# Altium project Aarons_MnDOT_Board_V1.1.PrjPcb
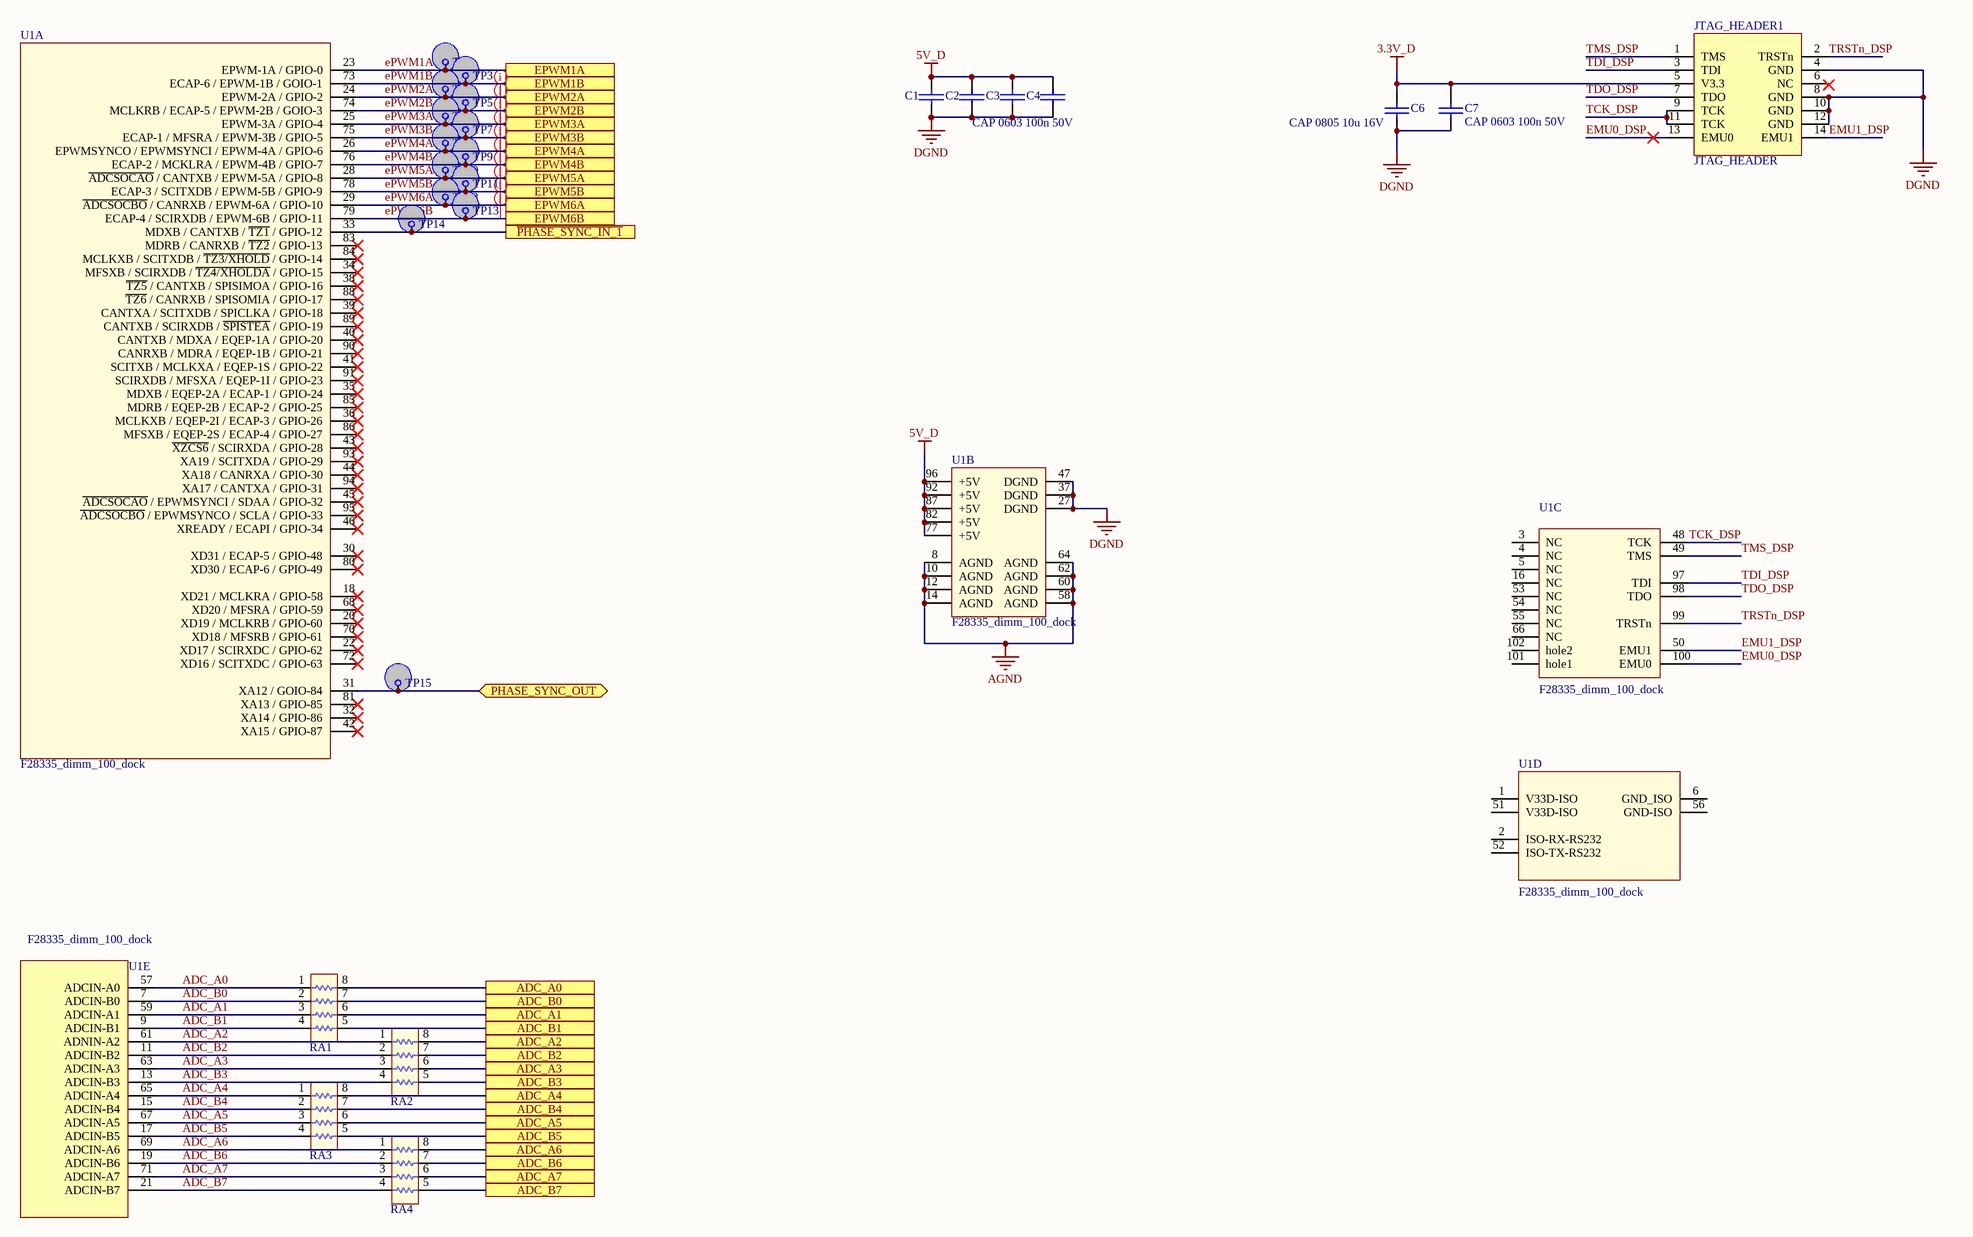
[diagram p0: F28335_V1.1.SchDoc]
3 sheets, 92 parts. Net scope: hierarchical (ports join the sheet entries above them; power ports are global).
Board file: Aarons_MnDOT_Board_V1.1.PcbDoc
Sheets:
  F28335_V1.1.SchDoc
  Power_Supply_V1.1.SchDoc
  Main_V1.1.SchDoc

## Sheet F28335_V1.1.SchDoc
size C

### Parts
C1  CAP 0603 100n 50V  [CAPC1608N]
C2  CAP 0603 100n 50V  [CAPC1608N]  (value not drawn)
C3  CAP 0603 100n 50V  [CAPC1608N]  (value not drawn)
C4  CAP 0603 100n 50V  [CAPC1608N]  (value not drawn)
C6  CAP 0805 10u 16V  [CAPC2012N]
C7  CAP 0603 100n 50V  [CAPC1608N]
JTAG_HEADER1  JTAG_HEADER  [JTag_Header]
RA1  EXB38V 0 OHM  [EXB38V]  (value not drawn)
RA2  EXB38V 0 OHM  [EXB38V]  (value not drawn)
RA3  EXB38V 0 OHM  [EXB38V]  (value not drawn)
RA4  EXB38V 0 OHM  [EXB38V]  (value not drawn)
TP2  TEST_POINT_HOOK  [Keystone 5000]  (value not drawn)
TP3  TEST_POINT_HOOK  [Keystone 5000]  (value not drawn)
TP4  TEST_POINT_HOOK  [Keystone 5000]  (value not drawn)
TP5  TEST_POINT_HOOK  [Keystone 5000]  (value not drawn)
TP6  TEST_POINT_HOOK  [Keystone 5000]  (value not drawn)
TP7  TEST_POINT_HOOK  [Keystone 5000]  (value not drawn)
TP8  TEST_POINT_HOOK  [Keystone 5000]  (value not drawn)
TP9  TEST_POINT_HOOK  [Keystone 5000]  (value not drawn)
TP10  TEST_POINT_HOOK  [Keystone 5000]  (value not drawn)
TP11  TEST_POINT_HOOK  [Keystone 5000]  (value not drawn)
TP12  TEST_POINT_HOOK  [Keystone 5000]  (value not drawn)
TP13  TEST_POINT_HOOK  [Keystone 5000]  (value not drawn)
TP14  TEST_POINT_HOOK  [Keystone 5000]  (value not drawn)
TP15  TEST_POINT_HOOK  [Keystone 5000]  (value not drawn)
U1  F28335_dimm_100_dock  [DIMM_100_100mil]  (parts A,B,C,D,E of 5)

### Ports
ADC_A0, ADC_A1, ADC_A2, ADC_A3, ADC_A4, ADC_A5, ADC_A6, ADC_A7, ADC_B0, ADC_B1, ADC_B2, ADC_B3, ADC_B4, ADC_B5, ADC_B6, ADC_B7, EPWM1A, EPWM1B, EPWM2A, EPWM2B, EPWM3A, EPWM3B, EPWM4A, EPWM4B, EPWM5A, EPWM5B, EPWM6A, EPWM6B, PHASE_SYNC_OUT, ~{PHASE_SYNC_IN_1}

### Nets
3.3V_D: C6.1 C7.1 JTAG_HEADER1.5(V3.3)
5V_D: C1.1 C2.1 C3.1 C4.1 U1.77(+5V) U1.82(+5V) U1.87(+5V) U1.92(+5V) U1.96(+5V)
AGND: U1.8(AGND) U1.10(AGND) U1.12(AGND) U1.14(AGND) U1.58(AGND) U1.60(AGND) U1.62(AGND) U1.64(AGND)
DGND: C1.2 C2.2 C3.2 C4.2 C6.2 C7.2 JTAG_HEADER1.4(GND) JTAG_HEADER1.8(GND) JTAG_HEADER1.10(GND) JTAG_HEADER1.12(GND) U1.27(DGND) U1.37(DGND) U1.47(DGND)
ADC_A0: RA1.1 U1.57(ADCIN-A0)
ADC_A1: RA1.3 U1.59(ADCIN-A1)
ADC_A2: RA2.1 U1.61(ADNIN-A2)
ADC_A3: RA2.3 U1.63(ADCIN-A3)
ADC_A4: RA3.1 U1.65(ADCIN-A4)
ADC_A5: RA3.3 U1.67(ADCIN-A5)
ADC_A6: RA4.1 U1.69(ADCIN-A6)
ADC_A7: RA4.3 U1.71(ADCIN-A7)
ADC_B0: RA1.2 U1.7(ADCIN-B0)
ADC_B1: RA1.4 U1.9(ADCIN-B1)
ADC_B2: RA2.2 U1.11(ADCIN-B2)
ADC_B3: RA2.4 U1.13(ADCIN-B3)
ADC_B4: RA3.2 U1.15(ADCIN-B4)
ADC_B5: RA3.4 U1.17(ADCIN-B5)
ADC_B6: RA4.2 U1.19(ADCIN-B6)
ADC_B7: RA4.4 U1.21(ADCIN-B7)
EMU0_DSP: JTAG_HEADER1.13(EMU0) U1.100(EMU0)
EMU1_DSP: JTAG_HEADER1.14(EMU1) U1.50(EMU1)
ePWM1A: TP2.1 U1.23(EPWM-1A_/_GPIO-0) ; port EPWM1A
ePWM1B: TP3.1 U1.73(ECAP-6_/_EPWM-1B_/_GOIO-1) ; port EPWM1B
ePWM2A: TP4.1 U1.24(EPWM-2A_/_GPIO-2) ; port EPWM2A
ePWM2B: TP5.1 U1.74(MCLKRB_/_ECAP-5_/_EPWM-2B_/_GOIO-3) ; port EPWM2B
ePWM3A: TP6.1 U1.25(EPWM-3A_/_GPIO-4) ; port EPWM3A
ePWM3B: TP7.1 U1.75(ECAP-1_/_MFSRA_/_EPWM-3B_/_GPIO-5) ; port EPWM3B
ePWM4A: TP8.1 U1.26(EPWMSYNCO_/_EPWMSYNCI_/_EPWM-4A_/_GPIO-6) ; port EPWM4A
ePWM4B: TP9.1 U1.76(ECAP-2_/_MCKLRA_/_EPWM-4B_/_GPIO-7) ; port EPWM4B
ePWM5A: TP10.1 U1.28(~{ADCSOCAO}_/_CANTXB_/_EPWM-5A_/_GPIO-8) ; port EPWM5A
ePWM5B: TP11.1 U1.78(ECAP-3_/_SCITXDB_/_EPWM-5B_/_GPIO-9) ; port EPWM5B
ePWM6A: TP12.1 U1.29(~{ADCSOCBO}_/_CANRXB_/_EPWM-6A_/_GPIO-10) ; port EPWM6A
ePWM6B: TP13.1 U1.79(ECAP-4_/_SCIRXDB_/_EPWM-6B_/_GPIO-11) ; port EPWM6B
TCK_DSP: JTAG_HEADER1.9(TCK) JTAG_HEADER1.11(TCK) U1.48(TCK)
TDI_DSP: JTAG_HEADER1.3(TDI) U1.97(TDI)
TDO_DSP: JTAG_HEADER1.7(TDO) U1.98(TDO)
TMS_DSP: JTAG_HEADER1.1(TMS) U1.49(TMS)
TRSTn_DSP: JTAG_HEADER1.2(TRSTn) U1.99(TRSTn)
NetRA1_5: RA1.5 ; port ADC_B1
NetRA1_6: RA1.6 ; port ADC_A1
NetRA1_7: RA1.7 ; port ADC_B0
NetRA1_8: RA1.8 ; port ADC_A0
NetRA2_5: RA2.5 ; port ADC_B3
NetRA2_6: RA2.6 ; port ADC_A3
NetRA2_7: RA2.7 ; port ADC_B2
NetRA2_8: RA2.8 ; port ADC_A2
NetRA3_5: RA3.5 ; port ADC_B5
NetRA3_6: RA3.6 ; port ADC_A5
NetRA3_7: RA3.7 ; port ADC_B4
NetRA3_8: RA3.8 ; port ADC_A4
NetRA4_5: RA4.5 ; port ADC_B7
NetRA4_6: RA4.6 ; port ADC_A7
NetRA4_7: RA4.7 ; port ADC_B6
NetRA4_8: RA4.8 ; port ADC_A6
NetTP14_1: TP14.1 U1.33(MDXB_/_CANTXB_/_~{TZ1}_/_GPIO-12) ; port ~{PHASE_SYNC_IN_1}
NetTP15_1: TP15.1 U1.31(XA12_/_GOIO-84) ; port PHASE_SYNC_OUT

Not connected (* = marked no-connect by the designer): JTAG_HEADER1 6(NC); U1 1(V33D-ISO) 2(ISO-RX-RS232) 3(NC) 4(NC) 5(NC) 6(GND_ISO) 16(NC) 18(XD21_/_MCLKRA_/_GPIO-58)* 20(XD19_/_MCLKRB_/_GPIO-60)* 22(XD17_/_SCIRXDC_/_GPIO-62)* 30(XD31_/_ECAP-5_/_GPIO-48)* 32(XA14_/_GPIO-86)* 34(MFSXB_/_SCIRXDB_/_~{TZ4/XHOLDA}_/_GPIO-15)* 35(MDXB_/_EQEP-2A_/_ECAP-1_/_GPIO-24)* 36(MCLKXB_/_EQEP-2I_/_ECAP-3_/_GPIO-26)* 38(~{TZ5}_/_CANTXB_/_SPISIMOA_/_GPIO-16)* 39(CANTXA_/_SCITXDB_/_SPICLKA_/_GPIO-18)* 40(CANTXB_/_MDXA_/_EQEP-1A_/_GPIO-20)* 41(SCITXB_/_MCLKXA_/_EQEP-1S_/_GPIO-22)* 42(XA15_/_GPIO-87)* 43(~{XZCS6}_/_SCIRXDA_/_GPIO-28)* 44(XA18_/_CANRXA_/_GPIO-30)* 45(~{ADCSOCAO}_/_EPWMSYNCI_/_SDAA_/_GPIO-32)* 46(XREADY_/_ECAPI_/_GPIO-34)* 51(V33D-ISO) 52(ISO-TX-RS232) 53(NC) 54(NC) 55(NC) 56(GND-ISO) 66(NC) 68(XD20_/_MFSRA_/_GPIO-59)* 70(XD18_/_MFSRB_/_GPIO-61)* 72(XD16_/_SCITXDC_/_GPIO-63)* 80(XD30_/_ECAP-6_/_GPIO-49)* 81(XA13_/_GPIO-85)* 83(MDRB_/_CANRXB_/_~{TZ2}_/_GPIO-13)* 84(MCLKXB_/_SCITXDB_/_~{TZ3/XHOLD}_/_GPIO-14)* 85(MDRB_/_EQEP-2B_/_ECAP-2_/_GPIO-25)* 86(MFSXB_/_EQEP-2S_/_ECAP-4_/_GPIO-27)* 88(~{TZ6}_/_CANRXB_/_SPISOMIA_/_GPIO-17)* 89(CANTXB_/_SCIRXDB_/_~{SPISTEA}_/_GPIO-19)* 90(CANRXB_/_MDRA_/_EQEP-1B_/_GPIO-21)* 91(SCIRXDB_/_MFSXA_/_EQEP-1I_/_GPIO-23)* 93(XA19_/_SCITXDA_/_GPIO-29)* 94(XA17_/_CANTXA_/_GPIO-31)* 95(~{ADCSOCBO}_/_EPWMSYNCO_/_SCLA_/_GPIO-33)* 101(hole1) 102(hole2)

### Layout directives
net class FPGA: ePWM2A, ePWM2B, ePWM3A, ePWM3B, ePWM4A, ePWM4B, ePWM5A, ePWM5B, ePWM6A, ePWM6B

### Library data of the parts
C1-C4 C7 = CAP 0603 TBD: Vendor: TBD; Part#: TBD; Manuf: TBD; Manuf#: TBD; Cost: TBD
C6 = CAP 0805 TBD: Vendor: TBD; Part#: TBD; Manuf: TBD; Manuf#: TBD; Cost: TBD
JTAG_HEADER1 = JTAG_HEADER: Part#: 929975E-01-05-ND; Manuf: 3M; Manuf#: 929975-01-05-RK; Vendor: Digikey; Cost@10: 1.807
RA1-RA4 = EXB38V: EXB38V 0603*4 TBD

## Sheet Power_Supply_V1.1.SchDoc
size A4
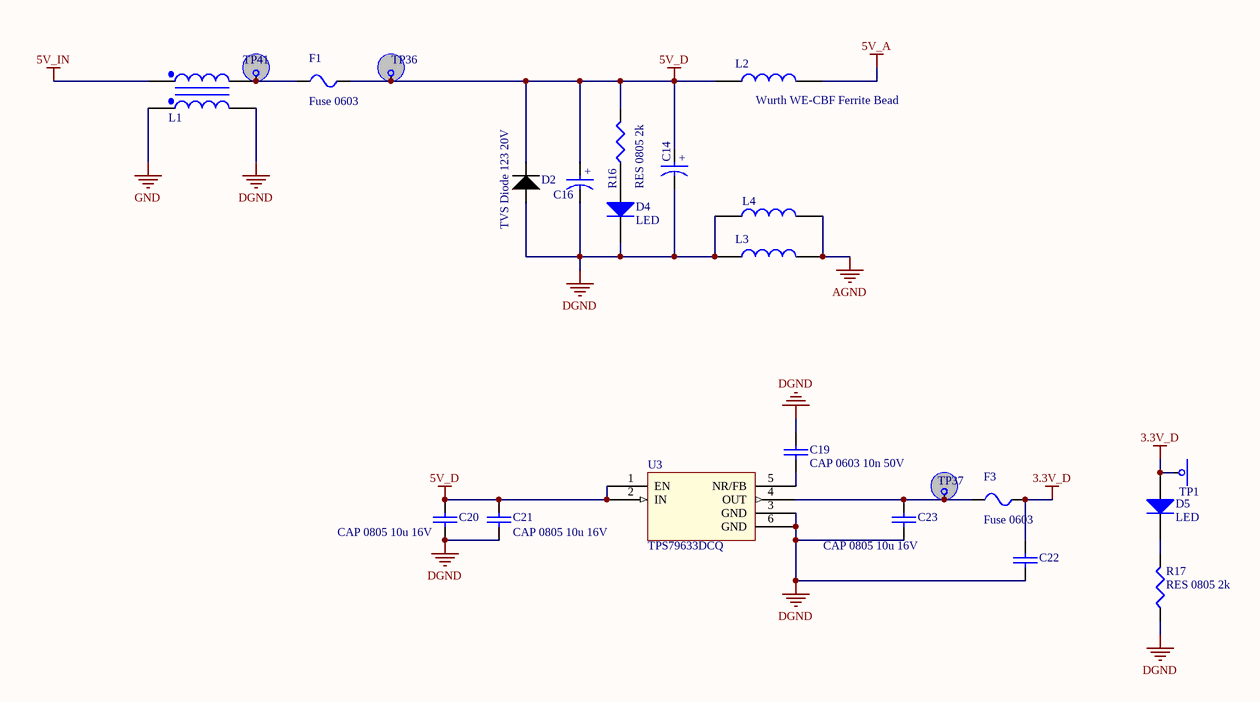
[diagram p1: Power_Supply_V1.1.SchDoc]

### Parts
C14  Panasonic SMD aluminum cap FT V size d  [Panasonic TF V SMD size D cap]  (value not drawn)
C16  Panasonic SMD aluminum cap FT V size d  [Panasonic TF V SMD size D cap]  (value not drawn)
C19  CAP 0603 10n 50V  [CAPC1608N]
C20  CAP 0805 10u 16V  [CAPC2012N]
C21  CAP 0805 10u 16V  [CAPC2012N]
C22  CAP 0805 10u 16V  [CAPC2012N]  (value not drawn)
C23  CAP 0805 10u 16V  [CAPC2012N]
D2  TVS Diode 123 20V  [SOD-123]
D4  LED  [LED1608N]
D5  LED  [LED1608N]
F1  Fuse 0603  [RES1608N]
F3  Fuse 0603  [RES1608N]
L1  Wurth  [WURTH WE-SL5]  (value not drawn)
L2  Wurth WE-CBF Ferrite Bead  [Wurth WE-CBF]  (value not drawn)
L3  Wurth WE-CBF Ferrite Bead  [Wurth WE-CBF]
L4  Wurth WE-CBF Ferrite Bead  [Wurth WE-CBF]  (value not drawn)
R16  RES 0805 2k  [RES2012N]
R17  RES 0805 2k  [RES2012N]
TP1  TEST_POINT_HOOK  [Keystone 5000]  (value not drawn)
TP36  *  [Keystone 5000]  (value not drawn)
TP37  *  [Keystone 5000]  (value not drawn)
TP41  TEST_POINT_HOOK  [Keystone 5000]  (value not drawn)
U3  TPS79633DCQ  [SOT-223-6]

### Nets
3.3V_D: C22.1 D5.1 F3.2 TP1.1
5V_A: L2.2
5V_D: C14.1 C16.1 C20.1 C21.1 D2.1(C) F1.2 L2.1 R16.2 TP36.1 U3.1(EN) U3.2(IN)
5V_IN: L1.1
AGND: L3.2 L4.2
DGND: C14.2 C16.2 C19.1 C20.2 C21.2 C22.2 C23.2 D2.2(A) D4.2 L1.3 L3.1 L4.1 R17.1 U3.3(GND) U3.6(GND)
GND: L1.4
NetC19_2: C19.2 U3.5(NR/FB)
NetC23_1: C23.1 F3.1 TP37.1 U3.4(OUT)
NetD4_1: D4.1 R16.1
NetD5_2: D5.2 R17.2
NetF1_1: F1.1 L1.2 TP41.1

### Notes on the sheet
- (in symbol Panasonic SMD aluminum cap FT V size d) +

### Library data of the parts
C14 C16 = Panasonic SMD aluminum cap FT V size d: Manuf: Panasonic - ECG; Vendor: DIGIKEY; Cost@10: 0.844
C19 = CAP 0603 TBD: Vendor: TBD; Part#: TBD; Manuf: TBD; Manuf#: TBD; Cost: TBD
C20-C23 = CAP 0805 TBD: Vendor: TBD; Part#: TBD; Manuf: TBD; Manuf#: TBD; Cost: TBD
D2 = TVS Diode TBD
D4 D5 = LED: Manuf: OSRAM; Manuf#: LG M67K-G1J2-24-0-2-R18-Z; Part#: 475-1406-1-ND; Vendor: Digikey; Cost@10: 0.17
L1 = Wurth WE-SL5: Wurth WE-SL5 Common Mode Choke; Part Number: 811-1253-ND; Manufacturer Part Number: 51105C; Manufacturer: Murata Power Solutions Inc; Vendor: Digikey; Packaging: Vertical, 4 PC Pin, Through hole
L2-L4 = Wurth WE-CBF: Wurth WE-CBF Ferrite Bead 2A 0.15Ohm; Part Number: 811-1253-ND; Manufacturer Part Number: 51105C; Manufacturer: Murata Power Solutions Inc; Vendor: Digikey; Packaging: Vertical, 4 PC Pin, Through hole
R16 R17 = RES 0805 TBD: Manuf#: TBD; Manuf: TBD; Vendor: TBD; Cost@10: TBD; Part#: TBD
TP36 TP37 = TEST_POINT_HOOK
U3 = TPS79633: Single Output LDO, 1.0A, Fixed(3.3V), Low Noise, High PSRR; Manufacturer_Part_Number: tps79633_dcq_6; Vendor: Texas Instruments; PACKAGE_DESIGNATOR: DCQ; PIN_COUNT: 6; FAMILY_NAME: SINGLE CHANNEL LDO; INDUSTRY_STD_PKG_TYPE: SOT-223; GENERIC_PART_NUMBER: TPS79633; Datasheet URL: http://www.ti.com/lit/gpn/TPS79633; Manufacturer: Texas Instruments; RefDes: RefDes; Type: DEV; Value: Value; Supplier 1: Digi-Key; Supplier 2: Newark

## Sheet Main_V1.1.SchDoc
size B
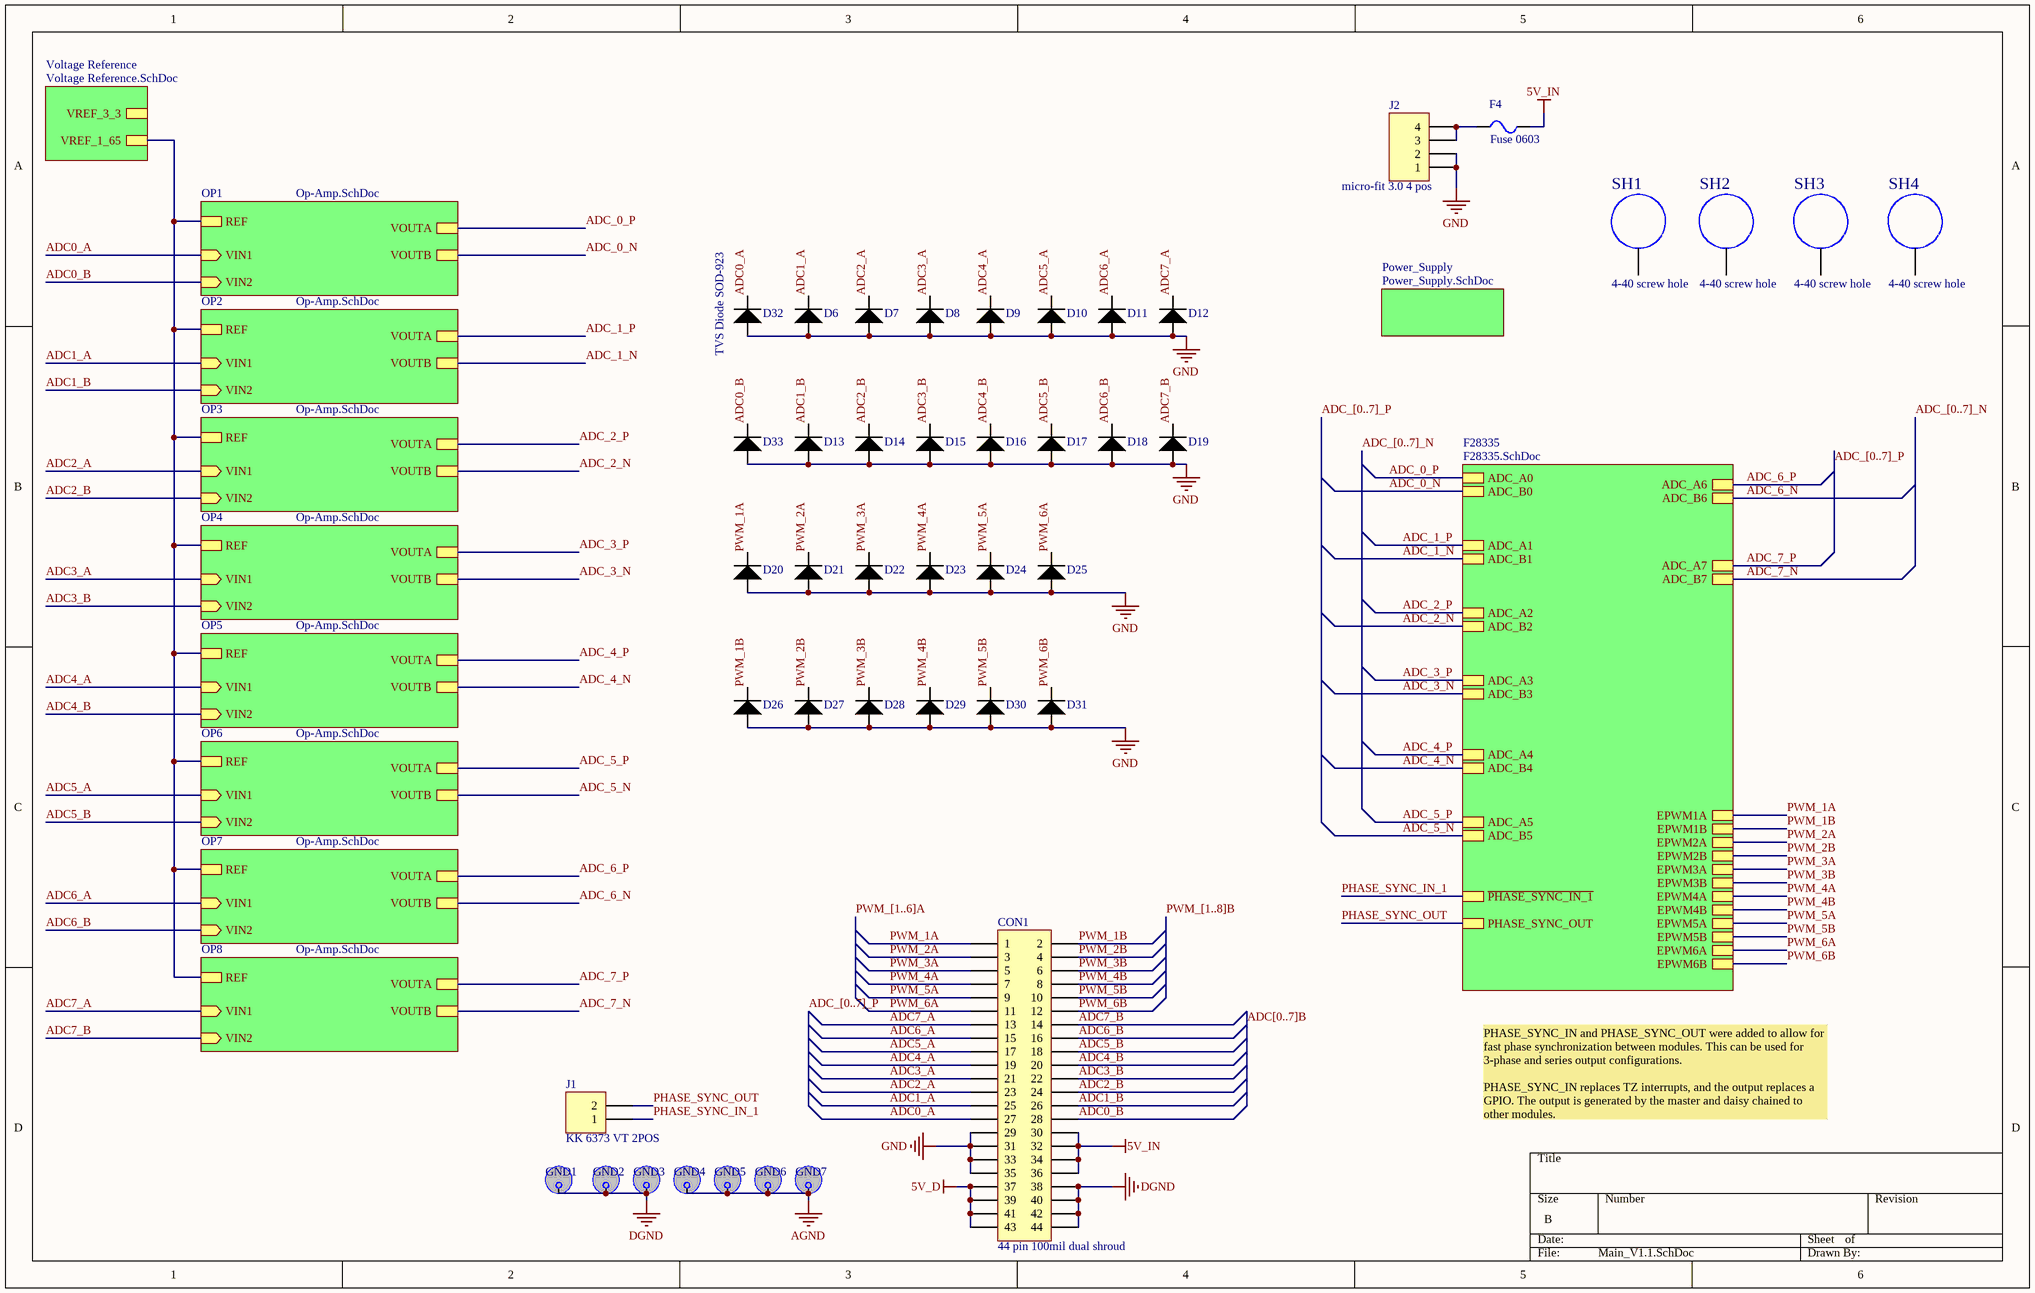
[diagram p2: Main_V1.1.SchDoc]

### Parts
CON1  44 pin 100mil dual shroud  [44 PIN 100 MIL DUAL UNSHROUD]
D6  TVS Diode SOD-923  [SOD-923-2]
D7  TVS Diode SOD-923  [SOD-923-2]  (value not drawn)
D8  TVS Diode SOD-923  [SOD-923-2]  (value not drawn)
D9  TVS Diode SOD-923  [SOD-923-2]  (value not drawn)
D10  TVS Diode SOD-923  [SOD-923-2]  (value not drawn)
D11  TVS Diode SOD-923  [SOD-923-2]  (value not drawn)
D12  TVS Diode SOD-923  [SOD-923-2]  (value not drawn)
D13  TVS Diode SOD-923  [SOD-923-2]  (value not drawn)
D14  TVS Diode SOD-923  [SOD-923-2]  (value not drawn)
D15  TVS Diode SOD-923  [SOD-923-2]  (value not drawn)
D16  TVS Diode SOD-923  [SOD-923-2]  (value not drawn)
D17  TVS Diode SOD-923  [SOD-923-2]  (value not drawn)
D18  TVS Diode SOD-923  [SOD-923-2]  (value not drawn)
D19  TVS Diode SOD-923  [SOD-923-2]  (value not drawn)
D20  TVS Diode SOD-923  [SOD-923-2]  (value not drawn)
D21  TVS Diode SOD-923  [SOD-923-2]  (value not drawn)
D22  TVS Diode SOD-923  [SOD-923-2]  (value not drawn)
D23  TVS Diode SOD-923  [SOD-923-2]  (value not drawn)
D24  TVS Diode SOD-923  [SOD-923-2]  (value not drawn)
D25  TVS Diode SOD-923  [SOD-923-2]  (value not drawn)
D26  TVS Diode SOD-923  [SOD-923-2]  (value not drawn)
D27  TVS Diode SOD-923  [SOD-923-2]  (value not drawn)
D28  TVS Diode SOD-923  [SOD-923-2]  (value not drawn)
D29  TVS Diode SOD-923  [SOD-923-2]  (value not drawn)
D30  TVS Diode SOD-923  [SOD-923-2]  (value not drawn)
D31  TVS Diode SOD-923  [SOD-923-2]  (value not drawn)
D32  TVS Diode SOD-923  [SOD-923-2]  (value not drawn)
D33  TVS Diode SOD-923  [SOD-923-2]  (value not drawn)
F4  Fuse 0603  [RES1608N]
GND1  *  [Keystone 5000]  (value not drawn)
GND2  *  [Keystone 5000]  (value not drawn)
GND3  *  [Keystone 5000]  (value not drawn)
GND4  *  [Keystone 5000]  (value not drawn)
GND5  *  [Keystone 5000]  (value not drawn)
GND6  *  [Keystone 5000]  (value not drawn)
GND7  *  [Keystone 5000]  (value not drawn)
J1  KK 6373 VT 2POS  [KK 6373 VT 2POS]
J2  micro-fit 3.0 4 pos  [micro-fit 3.0 4 pos dual line]
SH1  4-40 screw hole  [4-40 screw hole]
SH2  4-40 screw hole  [4-40 screw hole]
SH3  4-40 screw hole  [4-40 screw hole]
SH4  4-40 screw hole  [4-40 screw hole]

### Sub-sheets
F28335 = F28335.SchDoc (file not in this document): ADC_B0, ADC_B1, ADC_B2, ADC_B3, ADC_A0, ADC_A1, ADC_A2, ADC_A3, EPWM1A, EPWM1B, EPWM2A, EPWM2B, EPWM3A, EPWM3B, EPWM4A, EPWM4B, EPWM5A, EPWM5B, EPWM6A, EPWM6B, ADC_B4, ADC_A4, ADC_B5, ADC_A5, ~{PHASE_SYNC_IN_1}, PHASE_SYNC_OUT, ADC_A6, ADC_B6, ADC_B7, ADC_A7
OP1 = Op-Amp.SchDoc (file not in this document): VIN1 (in), VIN2 (in), VOUTA, VOUTB, REF
OP2 = Op-Amp.SchDoc (file not in this document): VIN1 (in), VIN2 (in), VOUTA, VOUTB, REF
OP3 = Op-Amp.SchDoc (file not in this document): VIN1 (in), VIN2 (in), VOUTA, VOUTB, REF
OP4 = Op-Amp.SchDoc (file not in this document): VIN1 (in), VIN2 (in), VOUTA, VOUTB, REF
OP5 = Op-Amp.SchDoc (file not in this document): VIN1 (in), VIN2 (in), VOUTA, VOUTB, REF
OP6 = Op-Amp.SchDoc (file not in this document): VIN1 (in), VIN2 (in), VOUTA, VOUTB, REF
OP7 = Op-Amp.SchDoc (file not in this document): VIN1 (in), VIN2 (in), VOUTA, VOUTB, REF
OP8 = Op-Amp.SchDoc (file not in this document): VIN1 (in), VIN2 (in), VOUTA, VOUTB, REF
Power_Supply = Power_Supply.SchDoc (file not in this document): no entries
Voltage Reference = Voltage Reference.SchDoc (file not in this document): VREF_1_65, VREF_3_3

### Nets
5V_D: CON1.37 CON1.39 CON1.41 CON1.43
5V_IN: CON1.30 CON1.32 CON1.34 CON1.36 F4.2
AGND: GND4.1 GND5.1 GND6.1 GND7.1
DGND: CON1.38 CON1.40 CON1.42 CON1.44 GND1.1 GND2.1 GND3.1
GND: CON1.29 CON1.31 CON1.33 CON1.35 D6.2(A) D7.2(A) D8.2(A) D9.2(A) D10.2(A) D11.2(A) D12.2(A) D13.2(A) D14.2(A) D15.2(A) D16.2(A) D17.2(A) D18.2(A) D19.2(A) D20.2(A) D21.2(A) D22.2(A) D23.2(A) D24.2(A) D25.2(A) D26.2(A) D27.2(A) D28.2(A) D29.2(A) D30.2(A) D31.2(A) D32.2(A) D33.2(A) J2.1 J2.2
ADC0_A: CON1.27 D32.1(C) ; sheet OP1/VIN1
ADC0_B: CON1.28 D33.1(C) ; sheet OP1/VIN2
ADC1_A: CON1.25 D6.1(C) ; sheet OP2/VIN1
ADC1_B: CON1.26 D13.1(C) ; sheet OP2/VIN2
ADC2_A: CON1.23 D7.1(C) ; sheet OP3/VIN1
ADC2_B: CON1.24 D14.1(C) ; sheet OP3/VIN2
ADC3_A: CON1.21 D8.1(C) ; sheet OP4/VIN1
ADC3_B: CON1.22 D15.1(C) ; sheet OP4/VIN2
ADC4_A: CON1.19 D9.1(C) ; sheet OP5/VIN1
ADC4_B: CON1.20 D16.1(C) ; sheet OP5/VIN2
ADC5_A: CON1.17 D10.1(C) ; sheet OP6/VIN1
ADC5_B: CON1.18 D17.1(C) ; sheet OP6/VIN2
ADC6_A: CON1.15 D11.1(C) ; sheet OP7/VIN1
ADC6_B: CON1.16 D18.1(C) ; sheet OP7/VIN2
ADC7_A: CON1.13 D12.1(C) ; sheet OP8/VIN1
ADC7_B: CON1.14 D19.1(C) ; sheet OP8/VIN2
ADC_0_N: sheet F28335/ADC_B0, sheet OP1/VOUTB
ADC_0_P: sheet F28335/ADC_A0, sheet OP1/VOUTA
ADC_1_N: sheet F28335/ADC_B1, sheet OP2/VOUTB
ADC_1_P: sheet F28335/ADC_A1, sheet OP2/VOUTA
ADC_2_N: sheet F28335/ADC_B2, sheet OP3/VOUTB
ADC_2_P: sheet F28335/ADC_A2, sheet OP3/VOUTA
ADC_3_N: sheet F28335/ADC_B3, sheet OP4/VOUTB
ADC_3_P: sheet F28335/ADC_A3, sheet OP4/VOUTA
ADC_4_N: sheet F28335/ADC_B4, sheet OP5/VOUTB
ADC_4_P: sheet F28335/ADC_A4, sheet OP5/VOUTA
ADC_5_N: sheet F28335/ADC_B5, sheet OP6/VOUTB
ADC_5_P: sheet F28335/ADC_A5, sheet OP6/VOUTA
ADC_6_N: sheet F28335/ADC_B6, sheet OP7/VOUTB
ADC_6_P: sheet F28335/ADC_A6, sheet OP7/VOUTA
ADC_7_N: sheet F28335/ADC_B7, sheet OP8/VOUTB
ADC_7_P: sheet F28335/ADC_A7, sheet OP8/VOUTA
PHASE_SYNC_IN_1: J1.1 ; sheet F28335/~{PHASE_SYNC_IN_1}
PHASE_SYNC_OUT: J1.2 ; sheet F28335/PHASE_SYNC_OUT
PWM_1A: CON1.1 D20.1(C) ; sheet F28335/EPWM1A
PWM_1B: CON1.2 D26.1(C) ; sheet F28335/EPWM1B
PWM_2A: CON1.3 D21.1(C) ; sheet F28335/EPWM2A
PWM_2B: CON1.4 D27.1(C) ; sheet F28335/EPWM2B
PWM_3A: CON1.5 D22.1(C) ; sheet F28335/EPWM3A
PWM_3B: CON1.6 D28.1(C) ; sheet F28335/EPWM3B
PWM_4A: CON1.7 D23.1(C) ; sheet F28335/EPWM4A
PWM_4B: CON1.8 D29.1(C) ; sheet F28335/EPWM4B
PWM_5A: CON1.9 D24.1(C) ; sheet F28335/EPWM5A
PWM_5B: CON1.10 D30.1(C) ; sheet F28335/EPWM5B
PWM_6A: CON1.11 D25.1(C) ; sheet F28335/EPWM6A
PWM_6B: CON1.12 D31.1(C) ; sheet F28335/EPWM6B
NetF4_1: F4.1 J2.3 J2.4
(unnamed): sheet OP1/REF, sheet Voltage Reference/VREF_1_65, sheet OP2/REF, sheet OP3/REF, sheet OP4/REF, sheet OP5/REF, sheet OP6/REF, sheet OP7/REF, sheet OP8/REF

Not connected (* = marked no-connect by the designer): SH1 1; SH2 1; SH3 1; SH4 1

### Buses and harness runs
bus ADC[0..7]B
bus ADC_[0..7]_N
bus ADC_[0..7]_P
bus PWM_[1..6]A
bus PWM_[1..8]B

### Notes on the sheet
- PHASE_SYNC_IN and PHASE_SYNC_OUT were added to allow for fast phase synchronization between modules. This can be used for 3-phase and series output configurations.
  PHASE_SYNC_IN replaces TZ interrupts, and the output replaces a GPIO. The output is generated by the master and daisy chained to other modules.

### Library data of the parts
CON1 = 44 pin 100mil dual shroud_1_1_1: 44 pin 100mil dual unshrouded header
GND1-GND7 = TEST_POINT_HOOK
J1 = KK 6373 VT 2POS: 1x2 Locking Header; Part#: WM4202-ND; Manuf: Molex/Waldom Electronics Corp; Vendor: DIGIKEY; Cost@10: 0.41; Manuf#: 22-23-2041
J2 = micro-fit 3.0 4 poS: Part#: 43045-0402; Manuf: Molex/Waldom Electronics Corp; Vendor: newark; Cost@10: 0.41; Manuf#: 22-23-2041

## Nets that join several sheets
3.3V_D: F28335_V1.1 (C6.1 C7.1 JTAG_HEADER1.5), Power_Supply_V1.1 (C22.1 D5.1 F3.2 TP1.1)
5V_D: F28335_V1.1 (9 pins), Power_Supply_V1.1 (11 pins), Main_V1.1 (CON1.37 CON1.39 CON1.41 CON1.43)
5V_IN: Power_Supply_V1.1 (L1.1), Main_V1.1 (5 pins)
AGND: F28335_V1.1 (8 pins), Power_Supply_V1.1 (L3.2 L4.2), Main_V1.1 (GND4.1 GND5.1 GND6.1 GND7.1)
DGND: F28335_V1.1 (13 pins), Power_Supply_V1.1 (15 pins), Main_V1.1 (7 pins)
GND: Power_Supply_V1.1 (L1.4), Main_V1.1 (34 pins)